# EAGLE design ZPlusSunSensorBoard (EAGLE 9.6.2)
DESIGNER: Thomas Christison; REV: B; REVIEWER: ADCS Electrical
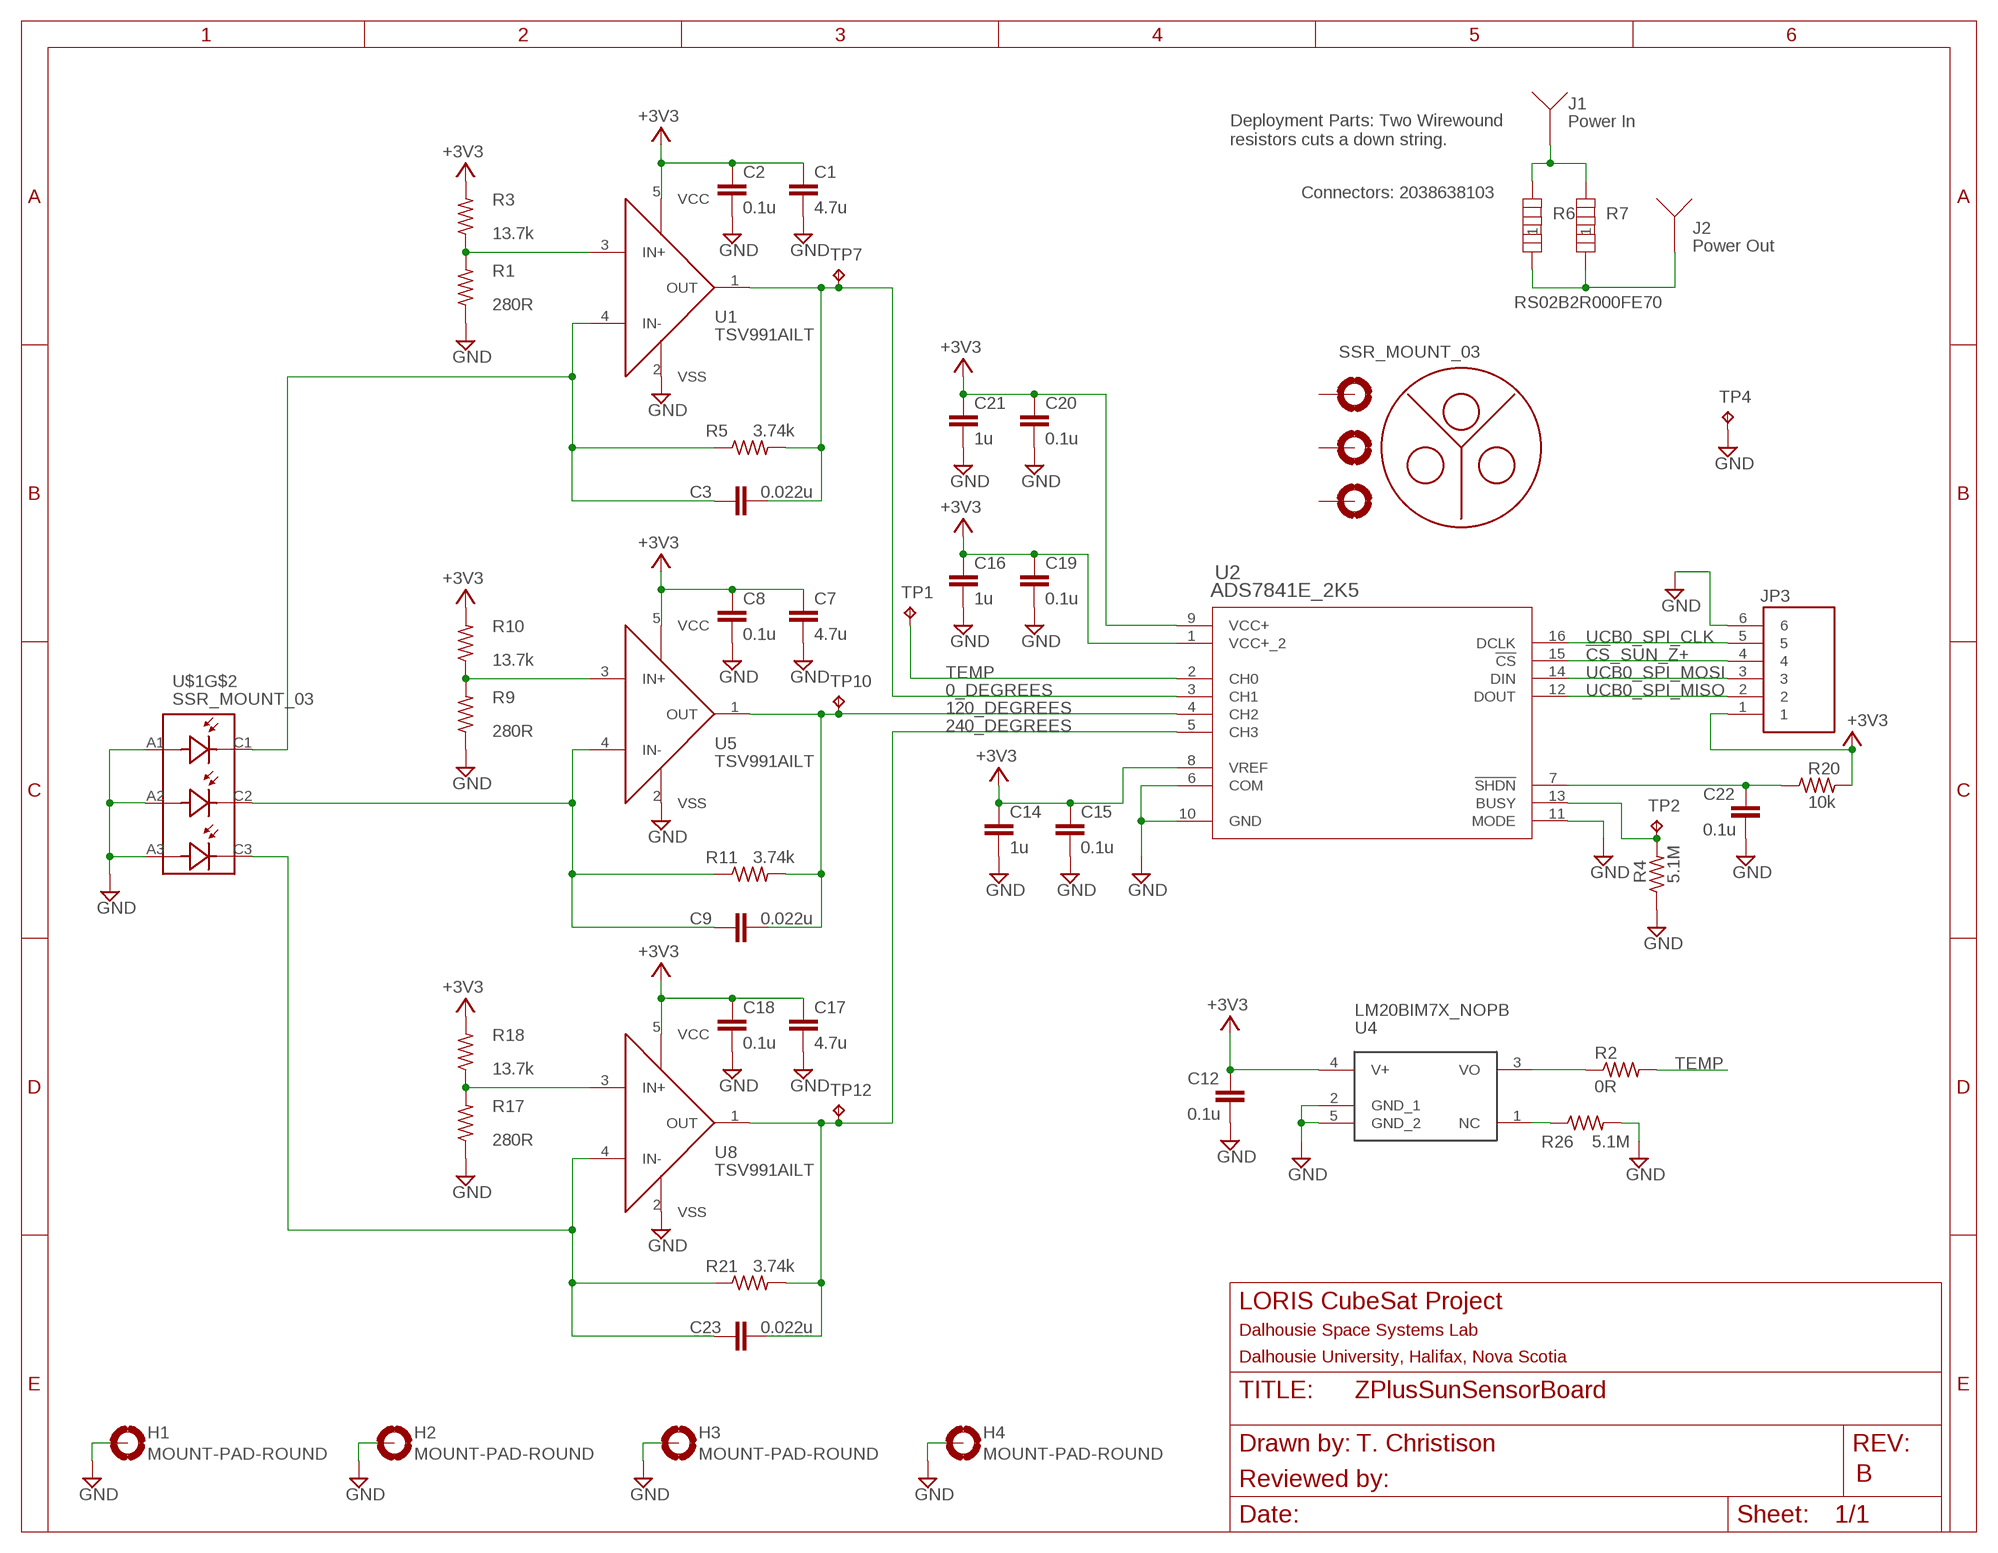
[diagram p0: schematic, sheet 1]

## Parts
C1  4.7u  C-EUC0805  [C0805]
C2  0.1u  C-EUC0402  [C0402]
C3  0.022u  C-EUC0402  [C0402]
C7  4.7u  C-EUC0805  [C0805]
C8  0.1u  C-EUC0402  [C0402]
C9  0.022u  C-EUC0402  [C0402]
C12  0.1u  C-EUC0402  [C0402]
C14  1u  C-EUC0402  [C0402]
C15  0.1u  C-EUC0402  [C0402]
C16  1u  C-EUC0402  [C0402]
C17  4.7u  C-EUC0805  [C0805]
C18  0.1u  C-EUC0402  [C0402]
C19  0.1u  C-EUC0402  [C0402]
C20  0.1u  C-EUC0402  [C0402]
C21  1u  C-EUC0402  [C0402]
C22  0.1u  C-EUC0402  [C0402]
C23  0.022u  C-EUC0402  [C0402]
H1  MOUNT-PAD-ROUND  [PC104]
H2  MOUNT-PAD-ROUND  [PC104]
H3  MOUNT-PAD-ROUND  [PC104]
H4  MOUNT-PAD-ROUND  [PC104]
J1  Power In  2038638103  [2038638103]
J2  Power Out  2038638103  [2038638103]
JP3  830-10-006-20-005000  [830-10-006-20-005000]
R1  280R  R-US_R0402  [R0402]
R2  0R  R-US_R0805  [R0805]
R3  13.7k  R-US_R0402  [R0402]
R4  5.1M  R-US_R0402  [R0402]
R5  3.74k  R-US_R0402  [R0402]
R6  RS02B2R000FE70  [ROX02B_VIS]
R7  RS02B2R000FE70  [ROX02B_VIS]
R9  280R  R-US_R0402  [R0402]
R10  13.7k  R-US_R0402  [R0402]
R11  3.74k  R-US_R0402  [R0402]
R17  280R  R-US_R0402  [R0402]
R18  13.7k  R-US_R0402  [R0402]
R20  10k  R-US_R0402  [R0402]
R21  3.74k  R-US_R0402  [R0402]
R26  5.1M  R-US_R0402  [R0402]
TP1  TESTPOINT  [TP_P76H50]
TP2  TESTPOINT  [TP_P76H50]
TP4  TESTPOINT  [TP_P76H50]
TP7  TESTPOINT  [TP_P76H50]
TP10  TESTPOINT  [TP_P76H50]
TP12  TESTPOINT  [TP_P76H50]
U1  TSV991AILT  [SOT95P280X145-5N]
U2  ADS7841E_2K5  [DBQ16]
U4  LM20BIM7X_NOPB  [SOT23-5P65_210X110L40X22N_LM20]
U5  TSV991AILT  [SOT95P280X145-5N]
U8  TSV991AILT  [SOT95P280X145-5N]
U$1  SSR_MOUNT_03  [SSR_MOUNT_03]

## Nets
0_DEGREES: C3.2 R5.2 TP7.1(TP) U1.1(OUT) U2.3(CH1)
120_DEGREES: C9.2 R11.2 TP10.1(TP) U2.4(CH2) U5.1(OUT)
240_DEGREES: C23.2 R21.2 TP12.1(TP) U2.5(CH3) U8.1(OUT)
!CS!_SUN_Z+: JP3.4 U2.15(!CS)
+3V3: C1.1 C2.1 C7.1 C8.1 C12.1 C14.1 C15.1 C16.1 C17.1 C18.1 C19.1 C20.1 C21.1 JP3.1 R3.2 R10.2 R18.2 R20.2 U1.5(VCC) U2.1(VCC+_2) U2.8(VREF) U2.9(VCC+) U4.4(V+) U5.5(VCC) U8.5(VCC)
GND: C1.2 C2.2 C7.2 C8.2 C12.2 C14.2 C15.2 C16.2 C17.2 C18.2 C19.2 C20.2 C21.2 C22.2 H1.B3,15(MOUNT) H2.B3,15(MOUNT) H3.B3,15(MOUNT) H4.B3,15(MOUNT) JP3.6 R1.1 R4.1 R9.1 R17.1 R26.2 TP4.1(TP) U1.2(VSS) U2.6(COM) U2.10(GND) U2.11(MODE) U4.2(GND_1) U4.5(GND_2) U5.2(VSS) U8.2(VSS) U$1.A1 U$1.A2 U$1.A3
N$1: R2.1 U4.3(VO)
N$2: R4.2 TP2.1(TP) U2.13(BUSY)
N$3: C3.1 R5.1 U1.4(IN-) U$1.C1
N$5: J1.P$1 R6.2 R7.2
N$6: J2.P$1 R6.1 R7.1
N$7: R26.1 U4.1(NC)
N$8: R1.2 R3.1 U1.3(IN+)
N$11: C9.1 R11.1 U5.4(IN-) U$1.C2
N$12: C23.1 R21.1 U8.4(IN-) U$1.C3
N$14: R9.2 R10.1 U5.3(IN+)
N$15: C22.1 R20.1 U2.7(!SHDN)
N$20: R17.2 R18.1 U8.3(IN+)
TEMP: R2.2 TP1.1(TP) U2.2(CH0)
UCB0_SPI_CLK: JP3.5 U2.16(DCLK)
UCB0_SPI_MISO: JP3.2 U2.12(DOUT)
UCB0_SPI_MOSI: JP3.3 U2.14(DIN)
Unconnected: U$1.1(MOUNT) U$1.2(MOUNT1) U$1.3(MOUNT2)

## Notes on the sheet
- Deployment Parts: Two Wirewound 
  resistors cuts a down string.
- Connectors: 2038638103
- T. Christison
- B

## Library data of the parts
C1 C7 C12 C17 = rcl:C-EU: CAPACITOR, European symbol; SPICEPREFIX: C
C2 C3 C8 C9 C14-C16 C18-C23 = resistor:C-EU: CAPACITOR, European symbol
H1-H4 = my_library:MOUNT-PAD-ROUND: MOUNTING PAD, round
J1 J2 = PDUv1:2038638103
JP3 = 830-10-006-20-005000:830-10-006-20-005000: Check prices <https://pricing.snapeda.com/parts/2355104-4/TE%20Connectivity/view-part?ref=eda>; AVAILABILITY: In Stock; COMMENT: 2355104-4; DESCRIPTION: Pin 4P,2MM,BRK HDR,SRVT,2.8,0.1AU,TB W/CAP 4 POS; MF: TE Connectivity; MP: 2355104-4; PACKAGE: None; PRICE: None; PURCHASE-URL: https://pricing.snapeda.com/search/part/2355104-4/?ref=eda
R1 R3-R5 R9-R11 R17 R18 R20 R21 = resistor:R-US_: RESISTOR, American symbol
R2 R26 = rcl:R-US_: RESISTOR, American symbol; SPICEPREFIX: R
R6 R7 = Heating Element:RS02B2R000FE70; BUILT_BY: EMA_UL_Team; MANUFACTURER_PART_NUMBER: RS02B2R000FE70; SOURCELIBRARY: Vishay_2014-12-31; VENDOR: Vishay
TP1 TP2 TP4 TP7 TP10 TP12 = my_library:TESTPOINT
U1 U5 U8 = my_library:TSV991AILT: TVS991 General Purpose Op-Amp
U2 = my_library:ADS7841E_2K5; DATASHEET_URL: http://www.ti.com/lit/gpn/ADS7841; DESCRIPTION: 12-Bit, 4-Channel Serial Output Sampling Analog-to-Digital Converter; FAMILY_NAME: PRECISION ADC (<=10MSPS); GENERIC_PART_NUMBER: ADS7841; INDUSTRY_STD_PKG_TYPE: SSOP/QSOP; MANUFACTURER: Texas Instruments; PACKAGE_DESIGNATOR: DBQ; PIN_COUNT: 16
U4 = my_library:LM20BIM7X_NOPB
U$1 = my_library:SSR_MOUNT_03

## Board
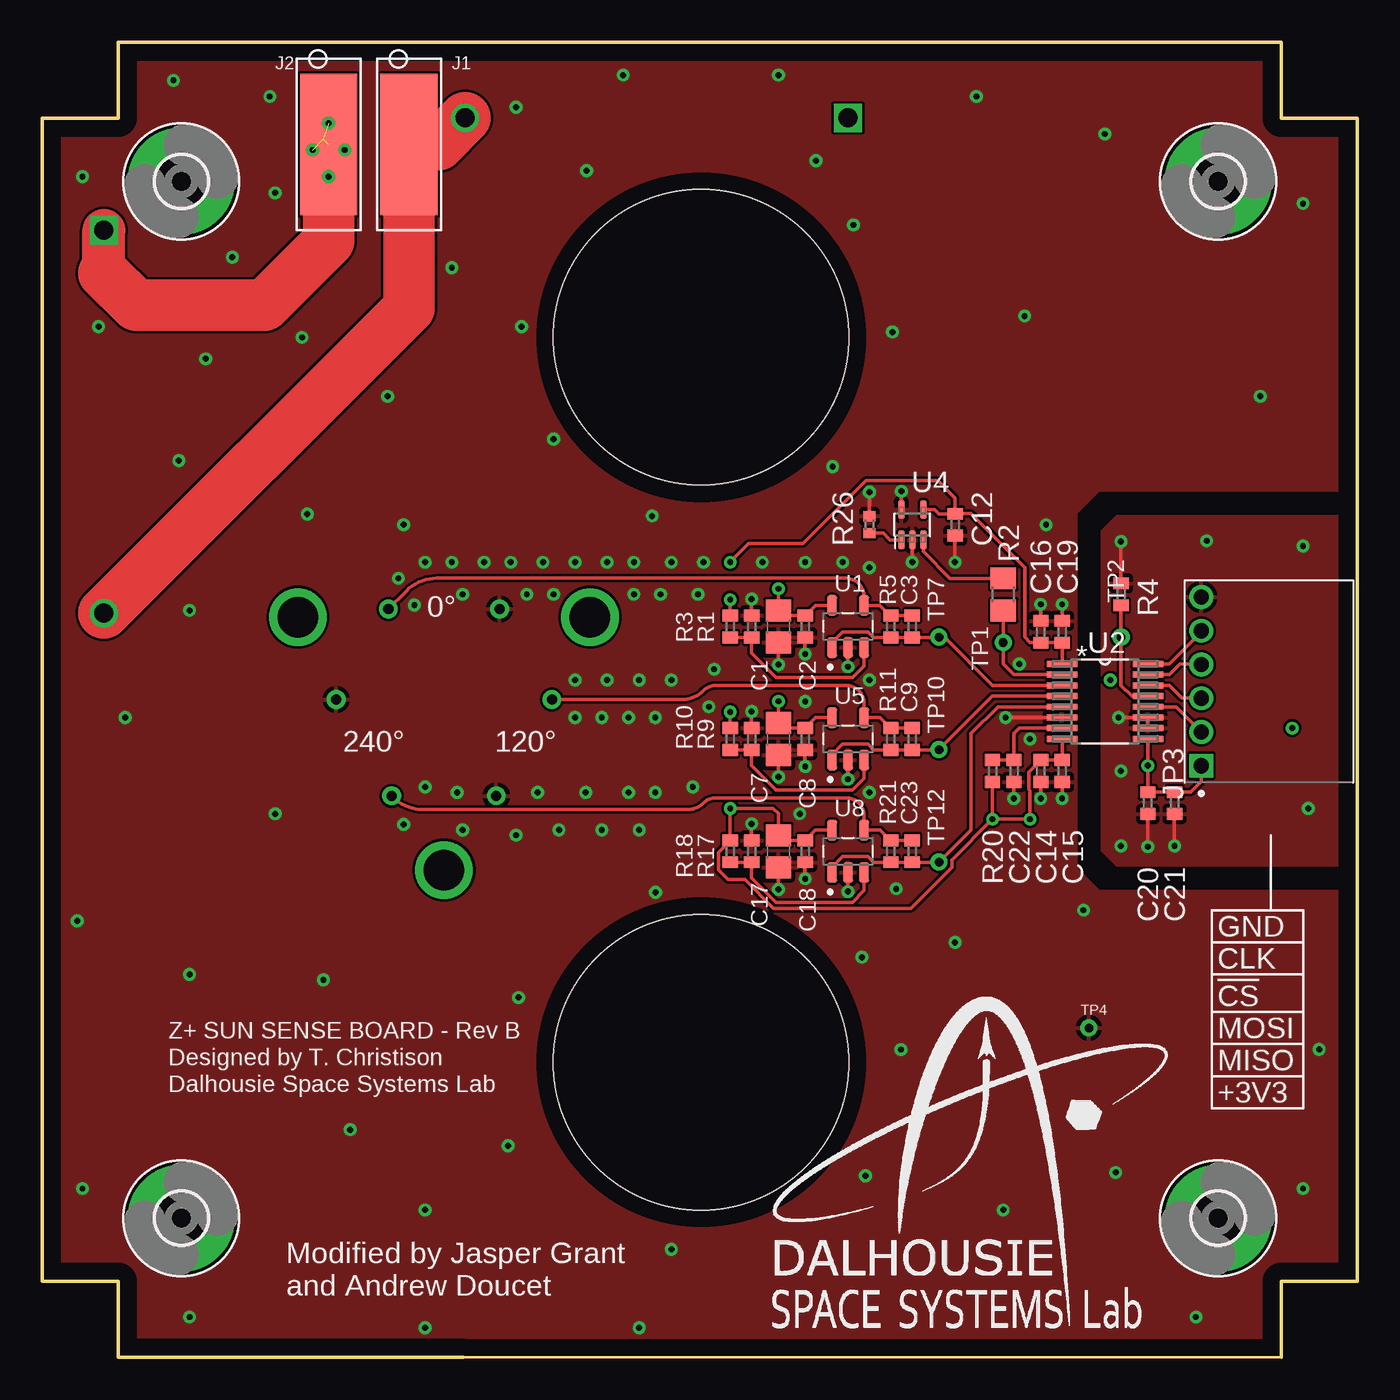
[diagram p1: board, top side]
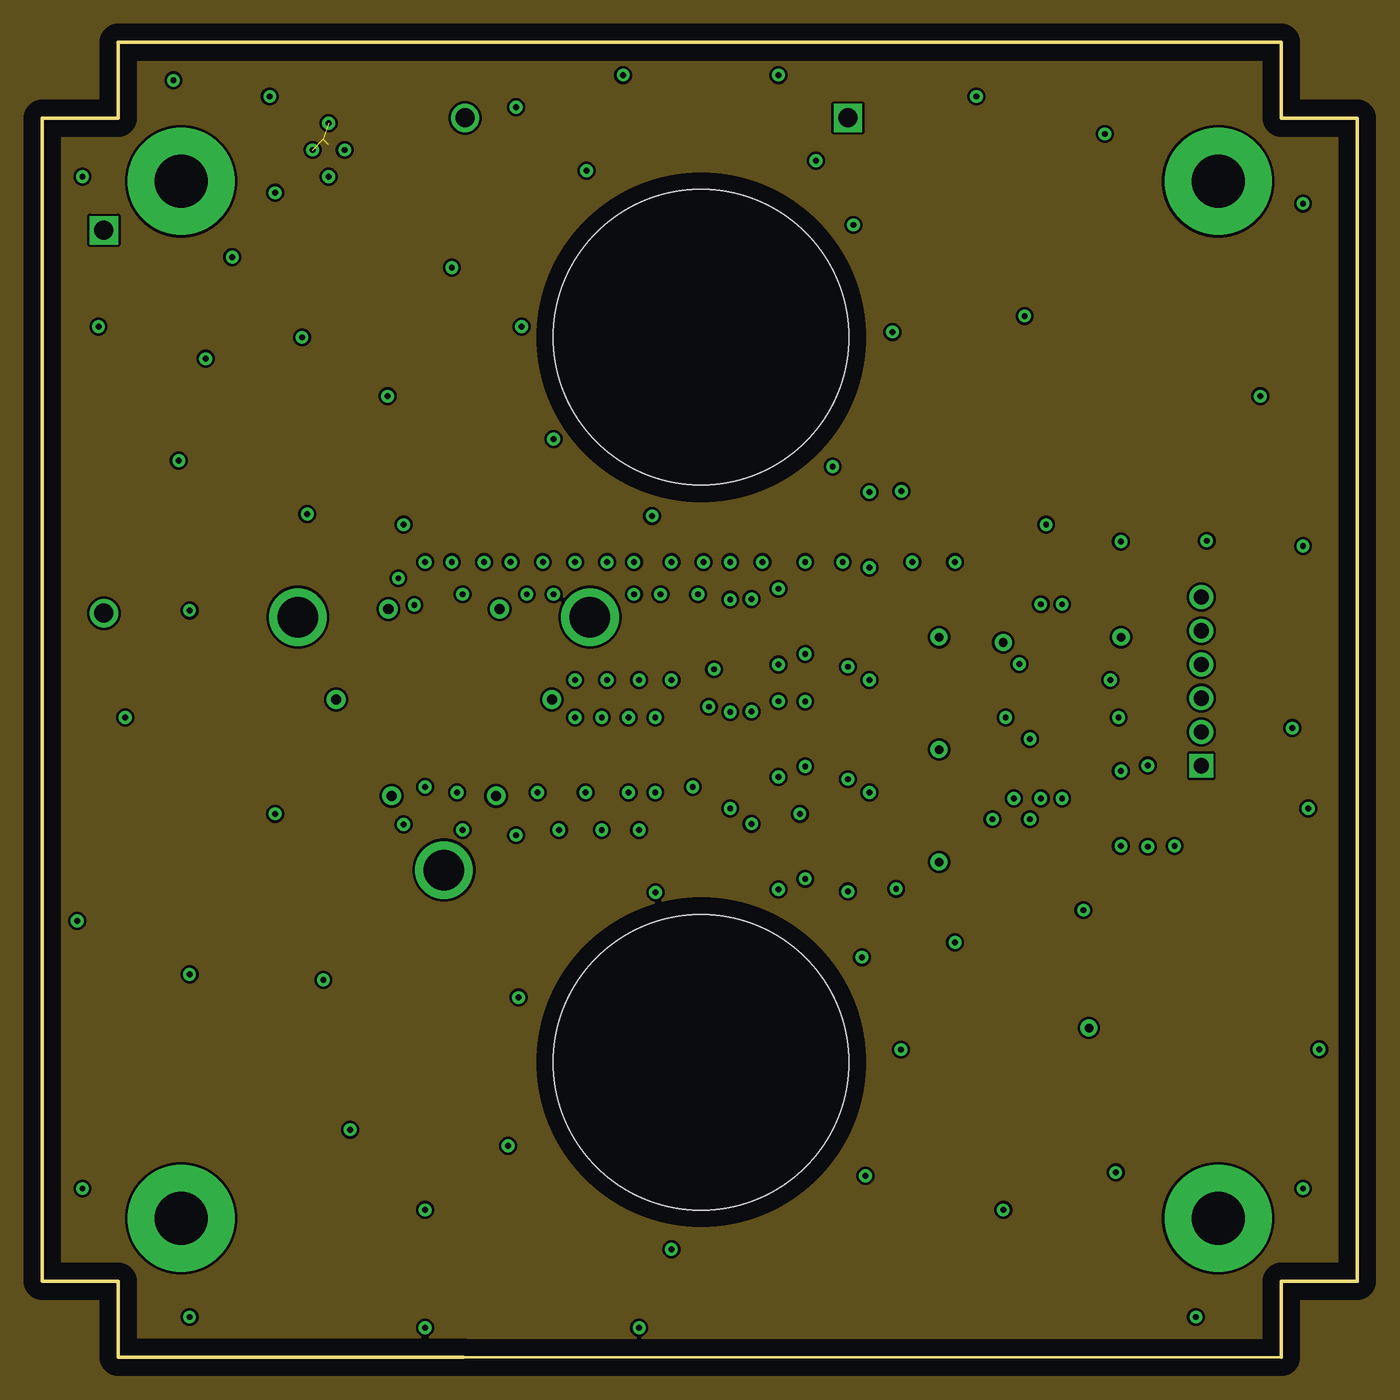
[diagram p2: board, inner layer Route2]
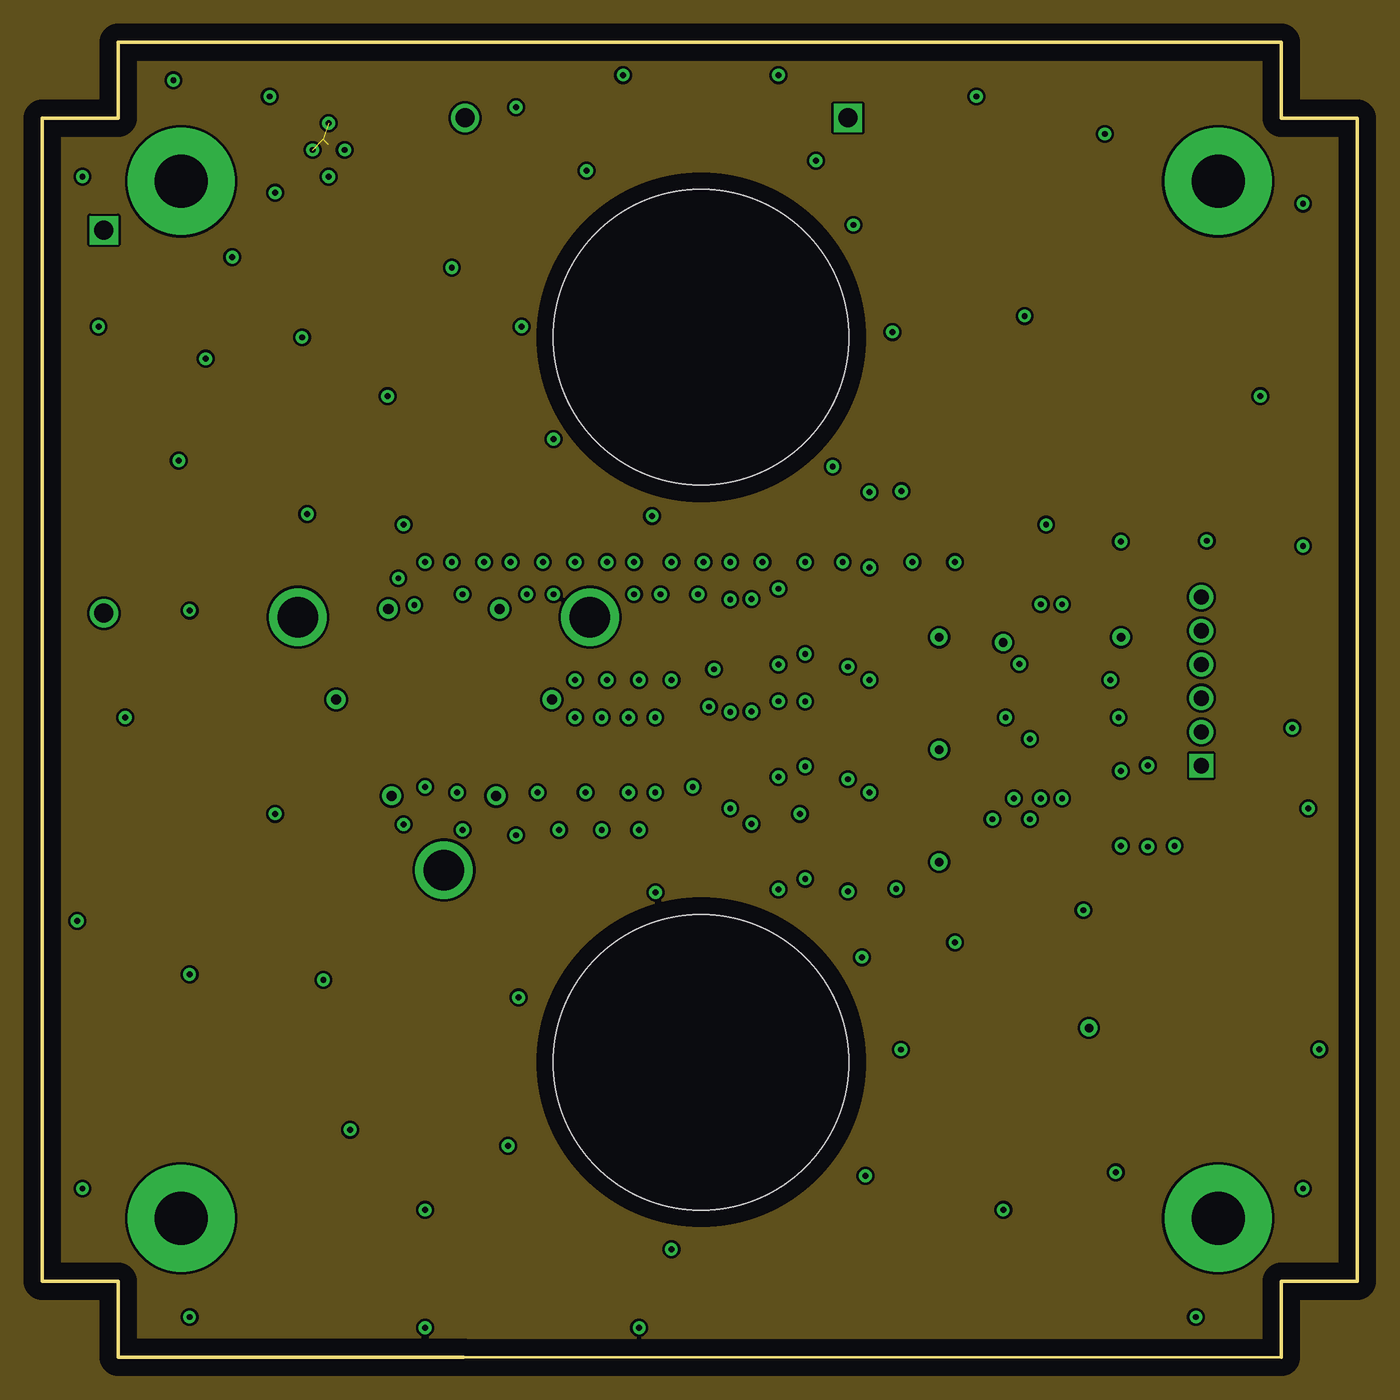
[diagram p3: board, inner layer Route15]
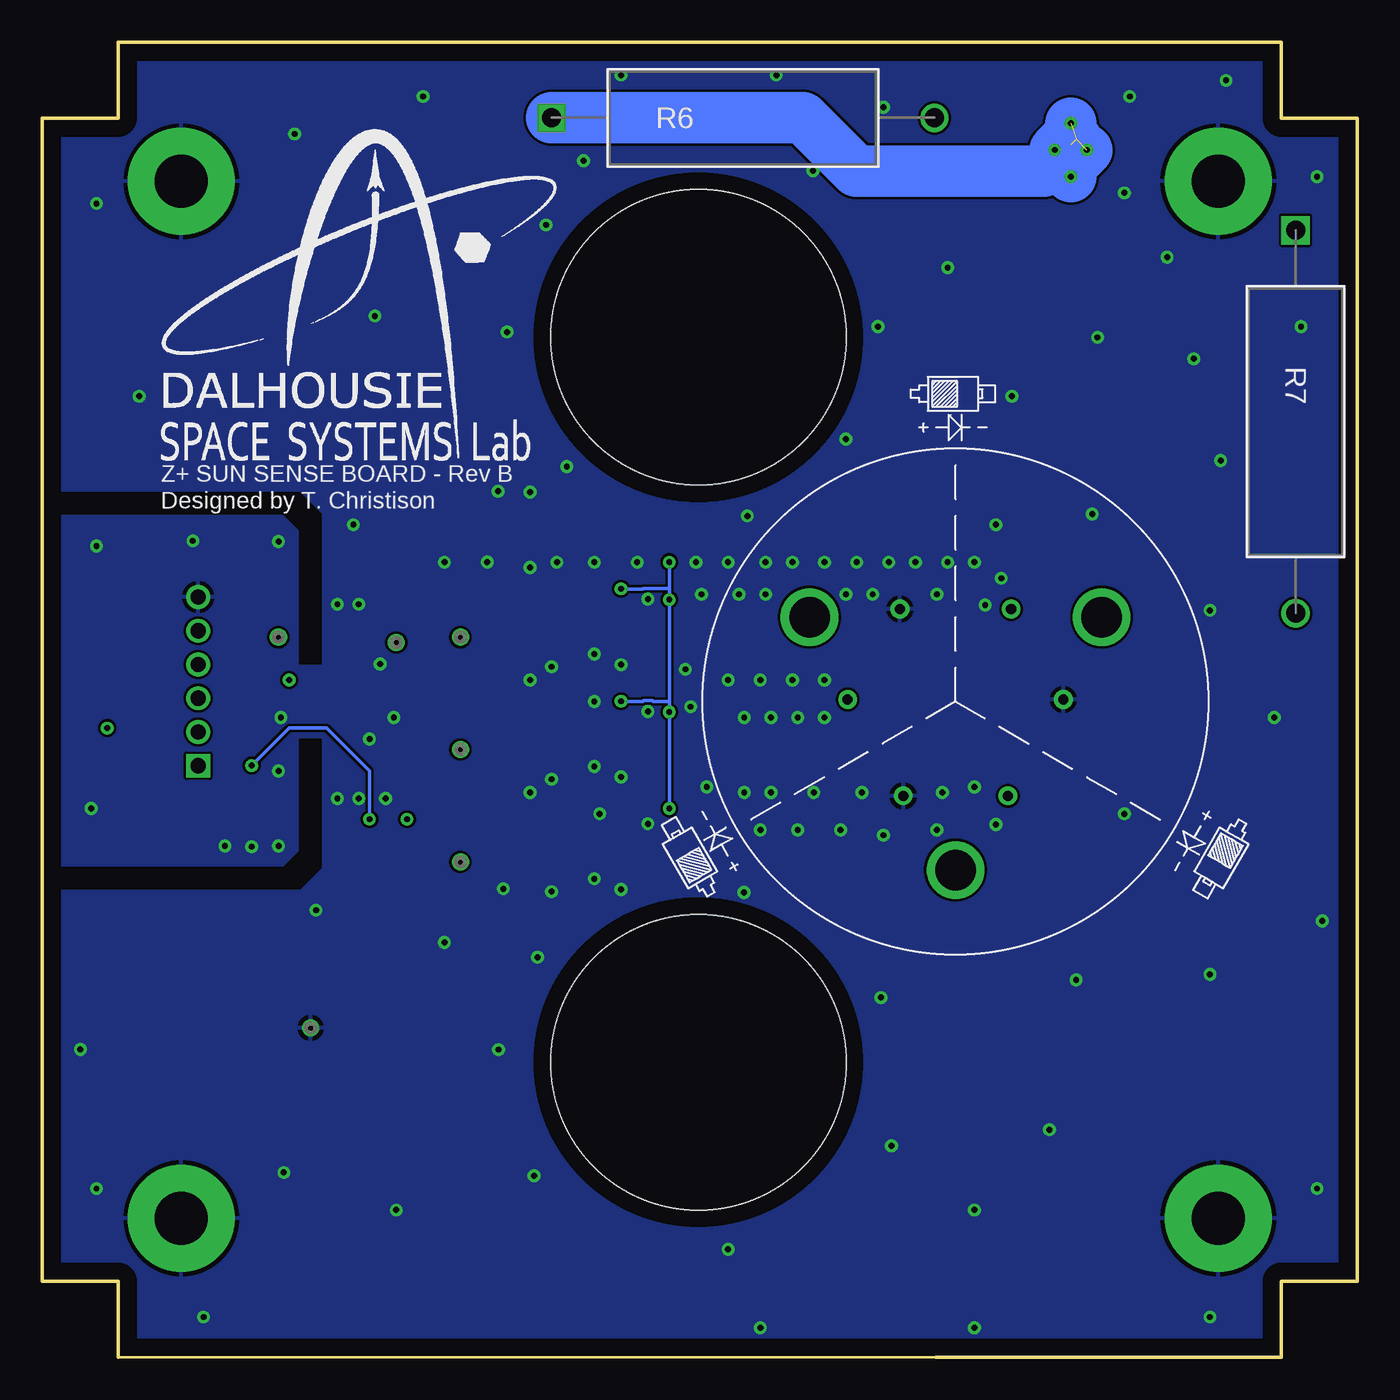
[diagram p4: board, bottom side, seen from below]

Size 78 x 78 mm. Coordinates in mm from the lower left corner, seen from the top.
Outline: 25,0 73.5,0 73.5,4.5 78,4.5 78,73.5 73.5,73.5 73.5,78 4.5,78 4.5,73.5 0,73.5 0,4.5 4.5,4.5 4.5,0 25,0
Copper layers (1*16): Top 0.035mm / dielectric 1.5mm / Bottom 0.035mm
Design rules "default": minimum track width 6mil, minimum drill 0.35mm, track to track 6mil, track to pad 6mil, pad to pad 6mil, via to via 6mil, smd to smd 6mil, copper to edge 40mil, drill to drill 6mil, minimum pad ring 10mil, minimum via ring 8mil, stop-mask expansion 4mil, vias tented up to drill 0mil, thermal gap 10mil
Holes 17.5 mm at 39.08,60.5 39.08,17.5

### Footprints (pad centres in the part's own frame; a part is rotated, then mirrored left to right if it is on the bottom)
C0805 = smd 1.3 x 1.5: 1 -0.95,0; 2 0.95,0
C0402 = smd 0.7 x 0.9: 1 -0.65,0; 2 0.65,0
PC104 = drill 3.15 pad 6.35: B3,15 0,0
2038638103 = smd 8.4 x 3.4: P$1 3.8,1.9
830-10-006-20-005000 = drill 0.9 pad 1.25 square: 1 0,0 | drill 0.9 pad 1.25: 2 2,0; 3 4,0; 4 6,0; 5 8,0; 6 10,0
R0402 = smd 0.7 x 0.9: 1 -0.65,0; 2 0.65,0
R0805 = smd 1.3 x 1.5: 1 -0.95,0; 2 0.95,0
ROX02B_VIS = drill 1.118 pad 1.626 square: 1 0,0 | drill 1.118 pad 1.626: 2 22.708,0
R0402' = smd 0.6 x 0.7: 1 -0.5,0; 2 0.5,0
TP_P76H50 = drill 0.51 pad 0.762: 1 0,0
SOT95P280X145-5N = smd 1.21 x 0.59: 1 -1.255,0.95; 2 -1.255,0; 3 -1.255,-0.95; 4 1.255,-0.95; 5 1.255,0.95
DBQ16 = smd 1.803 x 0.356: 1 -2.553,2.223; 2 -2.553,1.587; 3 -2.553,0.953; 4 -2.553,0.318; 5 -2.553,-0.318; 6 -2.553,-0.953; 7 -2.553,-1.587; 8 -2.553,-2.223; 9 2.553,-2.223; 10 2.553,-1.587; 11 2.553,-0.953; 12 2.553,-0.318; 13 2.553,0.318; 14 2.553,0.953; 15 2.553,1.587; 16 2.553,2.223
SOT23-5P65_210X110L40X22N_LM20 = smd 0.38 x 1.11: 1 -0.65,-0.9; 2 0,-0.9; 3 0.65,-0.9; 4 0.65,0.9; 5 -0.65,0.9
SSR_MOUNT_03 = drill 2.4: 1 -8.66,5; 2 8.66,5; 3 0,-10 | drill 0.6: A1 -3.3,5.48; A2 -3.1,-5.6; A3 6.4,0.12; C1 3.3,5.48; C2 -6.4,0.12; C3 3.1,-5.6

### Placement (x,y rotation side)
C1  43.66,43.35 270 top
C2  45.25,43.35 270 top
C3  51.6,43.35 270 top
C7  43.66,36.68 270 top
C8  45.25,36.68 270 top
C9  51.6,36.68 270 top
C12  54.14,49.38 270 top
C14  59.22,34.77 270 top
C15  60.49,34.77 270 top
C16  59.22,43.03 90 top
C17  43.66,30.01 270 top
C18  45.25,30.01 270 top
C19  60.49,43.03 90 top
C20  65.57,32.87 270 top
C21  67.16,32.87 270 top
C22  57.64,34.77 270 top
C23  51.6,30.01 270 top
H1  8.25,69.75 0 top
H2  8.25,8.25 0 top
H3  69.75,8.25 0 top
H4  69.75,69.75 0 top
J1  19.85,75.73 270 top
J2  15.09,75.73 270 top
JP3  68.75,35.09 90 top
R1  42.08,43.35 270 top
R2  57,45.25 270 top
R3  40.81,43.35 90 top
R4  63.98,45.25 270 top
R5  50.33,43.35 270 top
R6  47.79,73.51 0 bottom
R7  3.66,66.84 270 bottom
R9  42.08,36.68 270 top
R10  40.81,36.68 90 top
R11  50.33,36.68 270 top
R17  42.08,30.01 270 top
R18  40.81,30.01 90 top
R20  56.37,34.77 270 top
R21  50.33,30.01 270 top
R26  5.1M  [R0402']  49.06,49.38 90 top
TP1  57,42.4 180 top
TP2  63.98,42.71 0 top
TP4  62.08,19.54 0 top
TP7  53.19,42.71 0 top
TP10  53.19,36.05 0 top
TP12  53.19,29.38 0 top
U1  47.79,43.35 90 top
U2  63.03,38.9 0 top
U4  51.6,49.38 0 top
U5  47.79,36.68 90 top
U8  47.79,30.01 90 top
U$1  23.83,38.9 0 bottom
U$2  [PHOTODIODE_SILK]  8.74,30.01 60 bottom
U$3  [PHOTODIODE_SILK]  23.98,56.37 180 bottom
U$4  [PHOTODIODE_SILK]  38.9,30.01 300 bottom

### Tracks (layer width: path | path; a pad name or v marks a point on that pad's centre or on a via)
0_DEGREES
  Top 0.203: U1.1 46.84,42.4 47.48,43.03 48.98,43.03 49.31,42.7 R5.2 C3.2 53.17,42.7 TP7.1 53.51,42.71 56.37,39.85 U2.3
120_DEGREES
  Top 0.203: U5.1 46.84,35.73 47.48,36.36 48.98,36.36 49.31,36.03 R11.2 C9.2 53.17,36.03 TP10.1 56.37,39.22 U2.4
240_DEGREES
  Top 0.203: U2.5 56.68,38.59 55.09,37 55.09,31.28 TP12.1 53.17,29.36 C23.2 R21.2 49.31,29.36 48.98,29.7 47.48,29.7 46.84,29.06 U8.1
!CS!_SUN_Z+
  Top 0.152: 67.48,41.12 68.72,41.12 68.73,41.11 JP3.4
  Top 0.203: U2.15 66.84,40.49 67.48,41.12 67.49,41.11 | 68.73,41.11 67.49,41.11 | 67.49,41.11 67.51,41.12 68.72,41.12
+3V2
  pour Route15 (rank 6, no thermals): -10.95,87.48 -10.95,-10.31 88.75,-10.31 88.75,86.21 88.75,87.48
+3V3  (via drill 0.35)
  Top 0.152: 65.57,36.67 U2.9
  Top 0.203: U2.1 60.49,41.14 C19.1 60.47,42.41 59.25,42.41 C16.1 59.21,42.4 58.59,42.4 58.27,42.71 58.27,46.84 55.08,50.03 C12.1 | U2.8 60.49,36.67 C15.1 C14.1 58.52,34.72 58.52,33.67 58.59,33.6 v58.59,31.92 v56.37,31.92 | R20.2 v56.37,31.92 | C12.1 54.14,50.97 53.11,52 48.86,52 45.11,48.25 41.9,48.25 v40.81,47.16 | C12.1 54.13,50.02 53.19,50.02 52.92,50.28 U4.4 | U1.5 45.86,44.6 C2.1 43.97,44 C1.1 | C1.1 | C1.1 v43.66,45.58 | R3.2 v40.81,44.94 | U5.5 45.86,37.94 C8.1 43.97,37.33 C7.1 | C7.1 | C7.1 v43.66,38.91 | R10.2 v40.81,38.27 | U8.5 45.86,31.27 C18.1 43.97,30.66 C17.1 | C17.1 | C17.1 43.66,32.24 43.36,32.55 v40.81,32.55 R18.2 40.1,29.96 40.1,28.91 40.67,28.34 41.67,28.34 43.38,26.63 51.53,26.63 53.95,29.06 53.95,29.51 v56.37,31.92 | JP3.1 68.75,34.14 68.13,33.52 C21.1 C20.1 v65.57,35.09 65.57,36.67
  Bottom 0.203: v65.57,35.09 63.35,37.31 61.13,37.31 58.59,34.77 v58.59,31.92 | v40.81,32.55 v40.81,38.27 40.81,38.9 | 40.81,38.9 v40.81,44.94 40.81,45.57 | 40.81,45.57 v40.81,47.16 | v43.66,45.58 42.37,45.58 42.34,45.61 40.85,45.61 40.81,45.57 | 40.81,38.9 41.77,38.9 41.82,38.94 42.34,38.94 42.37,38.91 v43.66,38.91
+3V4
  pour Route15 (rank 6, no thermals): 103.99,147.17 103.99,49.38 203.69,49.38 203.69,145.9 203.69,147.17
+3V6
  pour Route15 (rank 6, no thermals): 116.06,121.14 116.06,23.34 215.75,23.34 215.75,119.86 215.75,121.14
+3V8
  pour Route15 (rank 6, no thermals): 104.62,99.55 104.62,1.76 204.32,1.76 204.32,98.28 204.32,99.55
GND  (via drill 0.35)
  Top 0.152: v63.84,37.95 63.67,37.95
  Top 0.203: R26.2 v49.06,51.31 | v51.6,47.17 U4.2 | U4.5 50.97,50.3 v50.97,51.37 | v54.14,47.16 C12.2 | U2.6 v57.14,37.95 | C15.2 v60.49,33.14 | C16.2 v59.22,44.66 | C19.2 v60.49,44.66 | C20.2 v65.57,30.29 | C21.2 v67.16,30.33 | v57.64,33.14 C22.2 | v59.22,33.14 C14.2 | C1.2 v43.66,41.08 | C2.2 v45.25,41.72 | v42.08,44.98 R1.1 | U1.2 v47.79,40.96 | C7.2 v43.66,34.41 | C8.2 v45.25,35.05 | v42.08,38.31 R9.1 | U5.2 v47.79,34.29 | C17.2 v43.66,27.75 | C18.2 v45.25,28.38 | v42.08,31.64 R17.1 | U8.2 v47.79,27.62 | U2.10 U2.11 63.67,37.95 | R4.1 v63.98,48.38
  other vias: 69.06,48.43 74.78,48.11 63.98,34.77 63.98,30.33 75.1,32.55 32.29,70.38 28.42,61.13 48.11,67.16 30.33,54.46 59.54,49.38 72.24,57 74.78,68.43 63.03,72.56 61.76,26.52 75.73,18.27 57,8.74 68.43,2.39 74.78,10.01 35.41,1.76 28.26,21.34 22.71,8.74 8.74,2.39 2.39,10.01 8.74,22.71 13.82,32.23 4.93,37.95 21.44,49.38 58.59,36.68 50.65,27.79 57.95,41.12 29.38,33.51 28.11,30.97 30.65,31.28 32.23,33.51 33.19,31.28 34.77,33.51 35.41,31.28 36.36,33.51 38.59,33.82 31.6,37.95 33.19,37.95 34.77,37.95 36.36,37.95 39.54,38.59 31.6,40.17 33.51,40.17 35.41,40.17 37.31,40.17 39.85,40.81 24.61,33.51 22.71,33.82 21.44,31.6 24.93,31.28 22.07,44.62 21.12,46.2 22.71,47.16 24.93,45.25 24.3,47.16 26.2,47.16 27.79,47.16 28.74,45.25 30.33,45.25 29.7,47.16 31.6,47.16 33.51,47.16 35.09,47.16 37.31,47.16 39.22,47.16 35.09,45.25 36.68,45.25 38.9,45.25 42.71,47.16 45.25,47.16 47.48,47.16 49.06,46.84 49.06,40.17 45.25,38.9 44.94,32.23 49.06,33.51 48.62,23.73 50.93,18.25 54.14,24.61 36.38,27.57 27.63,12.54 37.31,6.4 48.82,10.77 22.71,1.76 2.07,25.88 8.11,53.19 15.73,50.02 8.74,44.3 20.49,57 36.18,49.9 13.5,74.78 7.79,75.73 2.39,70.02 11.28,65.25 13.82,69.06 3.34,61.13 9.69,59.22 15.41,60.49 24.3,64.62 28.11,74.14 34.46,76.05 43.66,76.05 45.89,70.97 50.43,60.81 46.89,52.83 55.41,74.78 58.27,61.76 18.27,13.5 16.68,22.39 63.67,10.96
  cutout Top: 77.32,51.28 62.72,51.28 61.44,50.02 61.44,29.06 62.72,27.79 77.32,27.79 77.32,29.06 63.67,29.06 62.72,30.01 62.72,49.06 63.67,50.02 77.32,50.02
  cutout Bottom: 77.32,51.28 62.72,51.28 61.44,50.02 61.44,41.12 62.72,41.12 62.72,49.06 63.67,50.02 77.32,50.02
  cutout Bottom: 61.44,36.68 62.72,36.68 62.72,30.01 63.67,29.06 77.32,29.06 77.32,27.79 62.72,27.79 61.44,29.06
  pour Bottom: -3.36,79.86 83.35,79.86 86.21,77 86.21,5.25 76.69,-4.28 4.61,-4.28 -5.55,5.88 -3.36,8.07
  pour Top: -5.23,80.81 82.4,80.81 86.21,77 86.21,3.98 77.64,-4.59 4.29,-4.59 -5.23,4.93
GND2
  pour Route2 (no thermals): -7.13,85.58 85.58,85.58 85.58,-7.13 -7.13,-7.13
GND3
  pour Route2 (no thermals): 107.8,145.26 200.51,145.26 200.51,52.55 107.8,52.55
GND5
  pour Route2 (no thermals): 119.86,119.23 212.57,119.23 212.57,26.52 119.86,26.52
GND7
  pour Route2 (no thermals): 108.44,97.64 201.15,97.64 201.15,4.93 108.44,4.93
N$1
  Top 0.203: U4.3 52.25,47.78 53.83,46.2 R2.1
N$2
  Top 0.203: U2.13 64.62,39.22 63.98,39.85 TP2.1 R4.2
N$3
  Top 0.203: C3.1 R5.1 50.3,44 49.7,44.6 U1.4 | U1.4 | U1.4 48.74,45.12 arc45 48.43,45.89 arc45 47.65,46.21 43.4,46.21 43.4,46.2 23.41,46.2 arc45 21.61,45.46 U$1.C1
N$4  (via drill 0.35)
  other vias: 63.35,40.17
N$5
  Top 3.048: R6.2 23.51,71.93 J1.P$1 21.75,62.23 R7.2
N$6  (via drill 0.35)  (3 unrouted)
  Top 2.54: 3.66,64.3 R7.1
  Top 3.048: J2.P$1 16.99,66.2 13.18,62.4 5.56,62.4 3.66,64.3
  Bottom 3.048: 16.68,72.24 18.58,70.33 29.7,70.33 32.87,73.51 R6.1 | v16.04,71.61 17,70.65 v17,70.02 | v17,73.19 17,72.56 v17.95,71.61
N$7
  Top 0.203: R26.1 49.88,48.88 50.28,48.48 U4.1
N$8
  Top 0.203: R3.1 R1.2 42.08,41.77 43.53,40.33 48.05,40.33 48.74,41.01 U1.3
N$11
  Top 0.203: C9.1 R11.1 50.3,37.33 49.7,37.94 U5.4 | U5.4 | U$1.C2 37.97,39.02 arc45 39.22,39.54 arc-45 39.99,39.85 47.66,39.85 arc-45 48.43,39.54 arc-45 48.74,38.77 U5.4
N$12
  Top 0.203: C23.1 R21.1 50.3,30.66 49.7,31.27 U8.4 48.74,32.11 arc45 48.43,32.87 arc45 47.66,33.19 39.99,33.19 arc45 39.22,32.87 arc-45 38.31,32.49 22.59,32.49 arc-45 20.79,33.24 U$1.C3
N$14
  Top 0.203: R10.1 R9.2 42.08,35.11 43.53,33.66 48.05,33.66 48.74,34.34 U5.3
N$15
  Top 0.203: U2.7 57.95,37.31 57.64,37 C22.1 R20.1
N$20
  Top 0.203: U8.3 48.74,27.68 48.05,26.99 43.53,26.99 42.08,28.44 R17.2 R18.1
N$94  (via drill 0.35)
  other vias: 74.14,37.31
TEMP
  Top 0.203: R2.2 TP1.1 57.16,42.24 57,42.08 57,41.12 57.64,40.49 U2.2
UCB0_SPI_CLK
  Top 0.152: 68.75,43.03 JP3.5
  Top 0.203: U2.16 66.84,41.12 68.75,43.03
UCB0_SPI_MISO
  Top 0.203: U2.12 67.25,38.59 JP3.2
UCB0_SPI_MOSI
  Top 0.203: U2.14 66.84,39.85 67.61,39.09 JP3.3

### Text on the board
tPlace: Z+ SUN SENSE BOARD - Rev B | Designed by T. Christison | Dalhousie Space Systems Lab
bPlace: Z+ SUN SENSE BOARD - Rev B | Designed by T. Christison
tNames: GND | CLK | !CS | MOSI | MISO | +3V3 | Modified by Jasper Grant / and Andrew Doucet